# Altium project ALLINONE_V1.0.PrjPcb
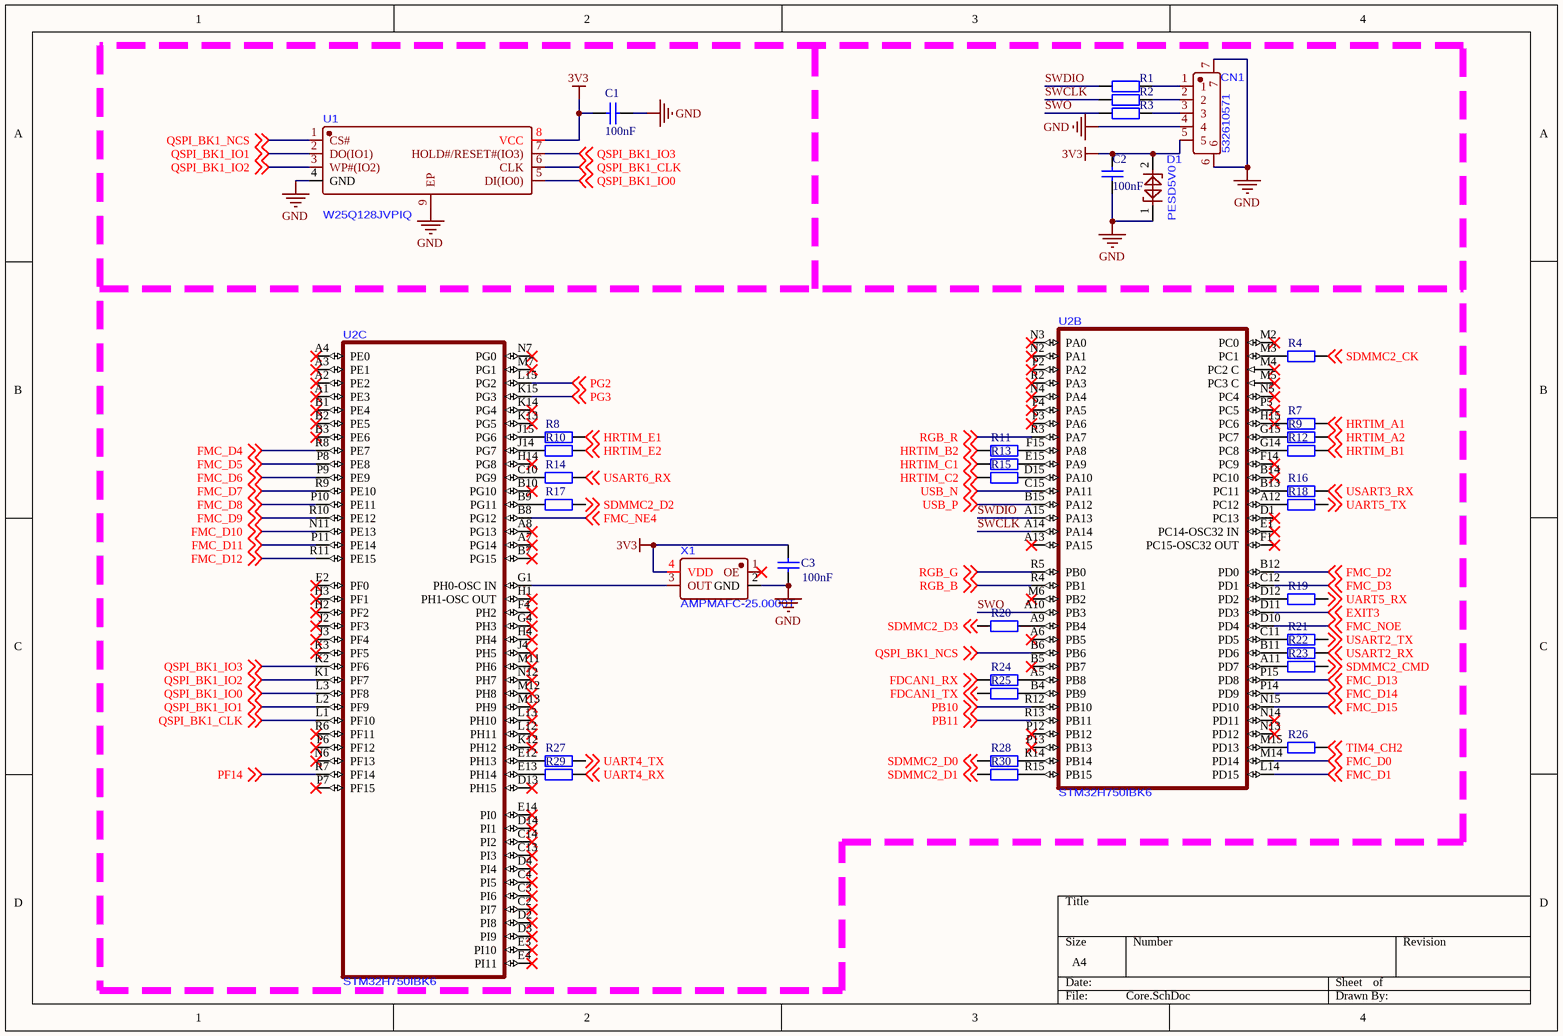
[diagram p0: Core.SchDoc]
7 sheets, 278 parts. Net scope: global (net labels, ports and power ports of the same name join across sheets).
Board file: ALLINONE_V1.0.PcbDoc
Sheets:
  Core.SchDoc
  Power_1.SchDoc
  Power_2.SchDoc
  ADC.SchDoc
  HBridge.SchDoc
  Port.SchDoc
  Others.SchDoc

## Sheet Core.SchDoc
size A4; SheetNumber: 1; SheetTotal: 7

### Parts
C1  100nF  [0402_C]
C2  100nF  [0402_C]
C3  100nF  [0402_C]
CN1  532610571  [CONN-SMD_5P-P1.25_532610571-2]
D1  PESD5V0  [SOD-882_L1.0-W0.6-BI]
R1  100Ω  [0402_R]  (value not drawn)
R2  100Ω  [0402_R]  (value not drawn)
R3  100Ω  [0402_R]  (value not drawn)
R4  10Ω  [0402_R]  (value not drawn)
R7  10Ω  [0402_R]  (value not drawn)
R8  10Ω  [0402_R]  (value not drawn)
R9  10Ω  [0402_R]  (value not drawn)
R10  10Ω  [0402_R]  (value not drawn)
R11  10Ω  [0402_R]  (value not drawn)
R12  10Ω  [0402_R]  (value not drawn)
R13  10Ω  [0402_R]  (value not drawn)
R14  10Ω  [0402_R]  (value not drawn)
R15  10Ω  [0402_R]  (value not drawn)
R16  10Ω  [0402_R]  (value not drawn)
R17  10Ω  [0402_R]  (value not drawn)
R18  10Ω  [0402_R]  (value not drawn)
R19  10Ω  [0402_R]  (value not drawn)
R20  10Ω  [0402_R]  (value not drawn)
R21  10Ω  [0402_R]  (value not drawn)
R22  10Ω  [0402_R]  (value not drawn)
R23  10Ω  [0402_R]  (value not drawn)
R24  10Ω  [0402_R]  (value not drawn)
R25  10Ω  [0402_R]  (value not drawn)
R26  10Ω  [0402_R]  (value not drawn)
R27  10Ω  [0402_R]  (value not drawn)
R28  10Ω  [0402_R]  (value not drawn)
R29  10Ω  [0402_R]  (value not drawn)
R30  10Ω  [0402_R]  (value not drawn)
U1  W25Q128JVPIQ  [WSON-8]
U2  STM32H750IBK6  [UFBGA176+25]  (parts B,C of 3)
X1  AMPMAFC-25.0000T  [OSC-SMD_4P-L2.0-W1.6-BL_ABRACON_AMPMAXXX]

### Nets
3V3: C1.2 C2.2 C3.2 CN1.5 D1.2 U1.8(VCC) X1.4(VDD)
GND: C1.1 C2.1 C3.1 CN1.4 CN1.6 CN1.7 D1.1 U1.4(GND) U1.9(EP) X1.2(GND)
EXIT3: U2.D11(PD3) ; off-sheet EXIT3
FDCAN1_RX: R24.1 ; off-sheet FDCAN1_RX
FDCAN1_TX: R25.1 ; off-sheet FDCAN1_TX
FMC_D0: U2.M14(PD14) ; off-sheet FMC_D0
FMC_D1: U2.L14(PD15) ; off-sheet FMC_D1
FMC_D2: U2.B12(PD0) ; off-sheet FMC_D2
FMC_D3: U2.C12(PD1) ; off-sheet FMC_D3
FMC_D4: U2.R8(PE7) ; off-sheet FMC_D4
FMC_D5: U2.P8(PE8) ; off-sheet FMC_D5
FMC_D6: U2.P9(PE9) ; off-sheet FMC_D6
FMC_D7: U2.R9(PE10) ; off-sheet FMC_D7
FMC_D8: U2.P10(PE11) ; off-sheet FMC_D8
FMC_D9: U2.R10(PE12) ; off-sheet FMC_D9
FMC_D10: U2.N11(PE13) ; off-sheet FMC_D10
FMC_D11: U2.P11(PE14) ; off-sheet FMC_D11
FMC_D12: U2.R11(PE15) ; off-sheet FMC_D12
FMC_D13: U2.P15(PD8) ; off-sheet FMC_D13
FMC_D14: U2.P14(PD9) ; off-sheet FMC_D14
FMC_D15: U2.N15(PD10) ; off-sheet FMC_D15
FMC_NE4: U2.B8(PG12) ; off-sheet FMC_NE4
FMC_NOE: U2.D10(PD4) ; off-sheet FMC_NOE
HRTIM_A1: R7.2 ; off-sheet HRTIM_A1
HRTIM_A2: R9.2 ; off-sheet HRTIM_A2
HRTIM_B1: R12.2 ; off-sheet HRTIM_B1
HRTIM_B2: R11.1 ; off-sheet HRTIM_B2
HRTIM_C1: R13.1 ; off-sheet HRTIM_C1
HRTIM_C2: R15.1 ; off-sheet HRTIM_C2
HRTIM_E1: R8.2 ; off-sheet HRTIM_E1
HRTIM_E2: R10.2 ; off-sheet HRTIM_E2
PB10: U2.R12(PB10) ; off-sheet PB10
PB11: U2.R13(PB11) ; off-sheet PB11
PF14: U2.R7(PF14) ; off-sheet PF14
PG2: U2.L15(PG2) ; off-sheet PG2
PG3: U2.K15(PG3) ; off-sheet PG3
QSPI_BK1_CLK: U1.6(CLK) U2.L1(PF10) ; off-sheet QSPI_BK1_CLK
QSPI_BK1_IO0: U1.5(DI(IO0)) U2.L3(PF8) ; off-sheet QSPI_BK1_IO0
QSPI_BK1_IO1: U1.2(DO(IO1)) U2.L2(PF9) ; off-sheet QSPI_BK1_IO1
QSPI_BK1_IO2: U1.3(WP#(IO2)) U2.K1(PF7) ; off-sheet QSPI_BK1_IO2
QSPI_BK1_IO3: U1.7(HOLD#/RESET#(IO3)) U2.K2(PF6) ; off-sheet QSPI_BK1_IO3
QSPI_BK1_NCS: U1.1(CS#) U2.B6(PB6) ; off-sheet QSPI_BK1_NCS
RGB_B: U2.R4(PB1) ; off-sheet RGB_B
RGB_G: U2.R5(PB0) ; off-sheet RGB_G
RGB_R: U2.R3(PA7) ; off-sheet RGB_R
SDMMC2_CK: R4.2 ; off-sheet SDMMC2_CK
SDMMC2_CMD: R23.2 ; off-sheet SDMMC2_CMD
SDMMC2_D0: R28.1 ; off-sheet SDMMC2_D0
SDMMC2_D1: R30.1 ; off-sheet SDMMC2_D1
SDMMC2_D2: R17.2 ; off-sheet SDMMC2_D2
SDMMC2_D3: R20.1 ; off-sheet SDMMC2_D3
SWCLK: R2.1 U2.A14(PA14)
SWDIO: R1.1 U2.A15(PA13)
SWO: R3.1 U2.A10(PB3)
TIM4_CH2: R26.2 ; off-sheet TIM4_CH2
UART4_RX: R29.1 ; off-sheet UART4_RX
UART4_TX: R27.1 ; off-sheet UART4_TX
UART5_RX: R19.1 ; off-sheet UART5_RX
UART5_TX: R18.1 ; off-sheet UART5_TX
USART2_RX: R22.2 ; off-sheet USART2_RX
USART2_TX: R21.2 ; off-sheet USART2_TX
USART3_RX: R16.2 ; off-sheet USART3_RX
USART6_RX: R14.2 ; off-sheet USART6_RX
USB_N: U2.C15(PA11) ; off-sheet USB_N
USB_P: U2.B15(PA12) ; off-sheet USB_P
NetCN1_1: CN1.1 R1.2
NetCN1_2: CN1.2 R2.2
NetCN1_3: CN1.3 R3.2
NetR4_1: R4.1 U2.M3(PC1)
NetR7_1: R7.1 U2.H15(PC6)
NetR8_1: R8.1 U2.J15(PG6)
NetR9_1: R9.1 U2.G15(PC7)
NetR10_1: R10.1 U2.J14(PG7)
NetR11_2: R11.2 U2.F15(PA8)
NetR12_1: R12.1 U2.G14(PC8)
NetR13_2: R13.2 U2.E15(PA9)
NetR14_1: R14.1 U2.C10(PG9)
NetR15_2: R15.2 U2.D15(PA10)
NetR16_1: R16.1 U2.B13(PC11)
NetR17_1: R17.1 U2.B9(PG11)
NetR18_2: R18.2 U2.A12(PC12)
NetR19_2: R19.2 U2.D12(PD2)
NetR20_2: R20.2 U2.A9(PB4)
NetR21_1: R21.1 U2.C11(PD5)
NetR22_1: R22.1 U2.B11(PD6)
NetR23_1: R23.1 U2.A11(PD7)
NetR24_2: R24.2 U2.A5(PB8)
NetR25_2: R25.2 U2.B4(PB9)
NetR26_1: R26.1 U2.M15(PD13)
NetR27_2: R27.2 U2.E12(PH13)
NetR28_2: R28.2 U2.R14(PB14)
NetR29_2: R29.2 U2.E13(PH14)
NetR30_2: R30.2 U2.R15(PB15)
NetU2_G1: U2.G1(PH0-OSC_IN) X1.3(OUT)

Not connected (* = marked no-connect by the designer): U2 A1(PE3)* A2(PE2)* A3(PE1)* A4(PE0)* A6(PB5)* A7(PG14)* A8(PG13)* A13(PA15)* B1(PE4)* B2(PE5)* B3(PE6)* B5(PB7)* B7(PG15)* B10(PG10)* B14(PC10)* C2(PI7)* C3(PI6)* C4(PI5)* C13(PI3)* C14(PI2)* D1(PC13)* D2(PI8)* D3(PI9)* D4(PI4)* D13(PH15)* D14(PI1)* E1(PC14-OSC32_IN)* E2(PF0)* E3(PI10)* E4(PI11)* E14(PI0)* F1(PC15-OSC32_OUT)* F4(PH2)* F14(PC9)* G4(PH3)* H1(PH1-OSC_OUT)* H2(PF2)* H3(PF1)* H4(PH4)* H14(PG8)* J2(PF3)* J3(PF4)* J4(PH5)* K3(PF5)* K12(PH12)* K13(PG5)* K14(PG4)* L12(PH11)* L13(PH10)* M2(PC0)* M4(PC2_C)* M5(PC3_C)* M6(PB2)* M7(PG1)* M11(PH6)* M12(PH8)* M13(PH9)* N2(PA1)* N3(PA0)* N4(PA4)* N5(PC4)* N6(PF13)* N7(PG0)* N12(PH7)* N13(PD12)* N14(PD11)* P2(PA2)* P3(PA6)* P4(PA5)* P5(PC5)* P6(PF12)* P7(PF15)* P12(PB12)* P13(PB13)* R2(PA3)* R6(PF11)*; X1 1(OE)*

### Library data of the parts
C1-C3 = 0402 100nF (104) 10% 16V: 贴片电容; ComponentLink1Description: 供应商链接; ComponentLink1URL: http://www.szlcsc.com/product/details_1877.html; Package: 0402; Supplier: LC; SuppliersPartNumber: C1525
D1 = PESD5V0F1BL,315
R1-R3 = 0402 10KΩ (1002) 1%: 贴片电阻; ComponentLink1Description: 供应商链接; ComponentLink1URL: http://www.szlcsc.com/product/details_26487.html; Package: 0402; Supplier: LC; SuppliersPartNumber: C25744
R4 R7-R30 = 0402 10Ω (10R0) 1%: 贴片电阻; ComponentLink1Description: 供应商链接; ComponentLink1URL: http://www.szlcsc.com/product/details_25820.html; Package: 0402; Supplier: LC; SuppliersPartNumber: C25077

## Sheet Power_1.SchDoc
size A4; SheetNumber: 2; SheetTotal: 6
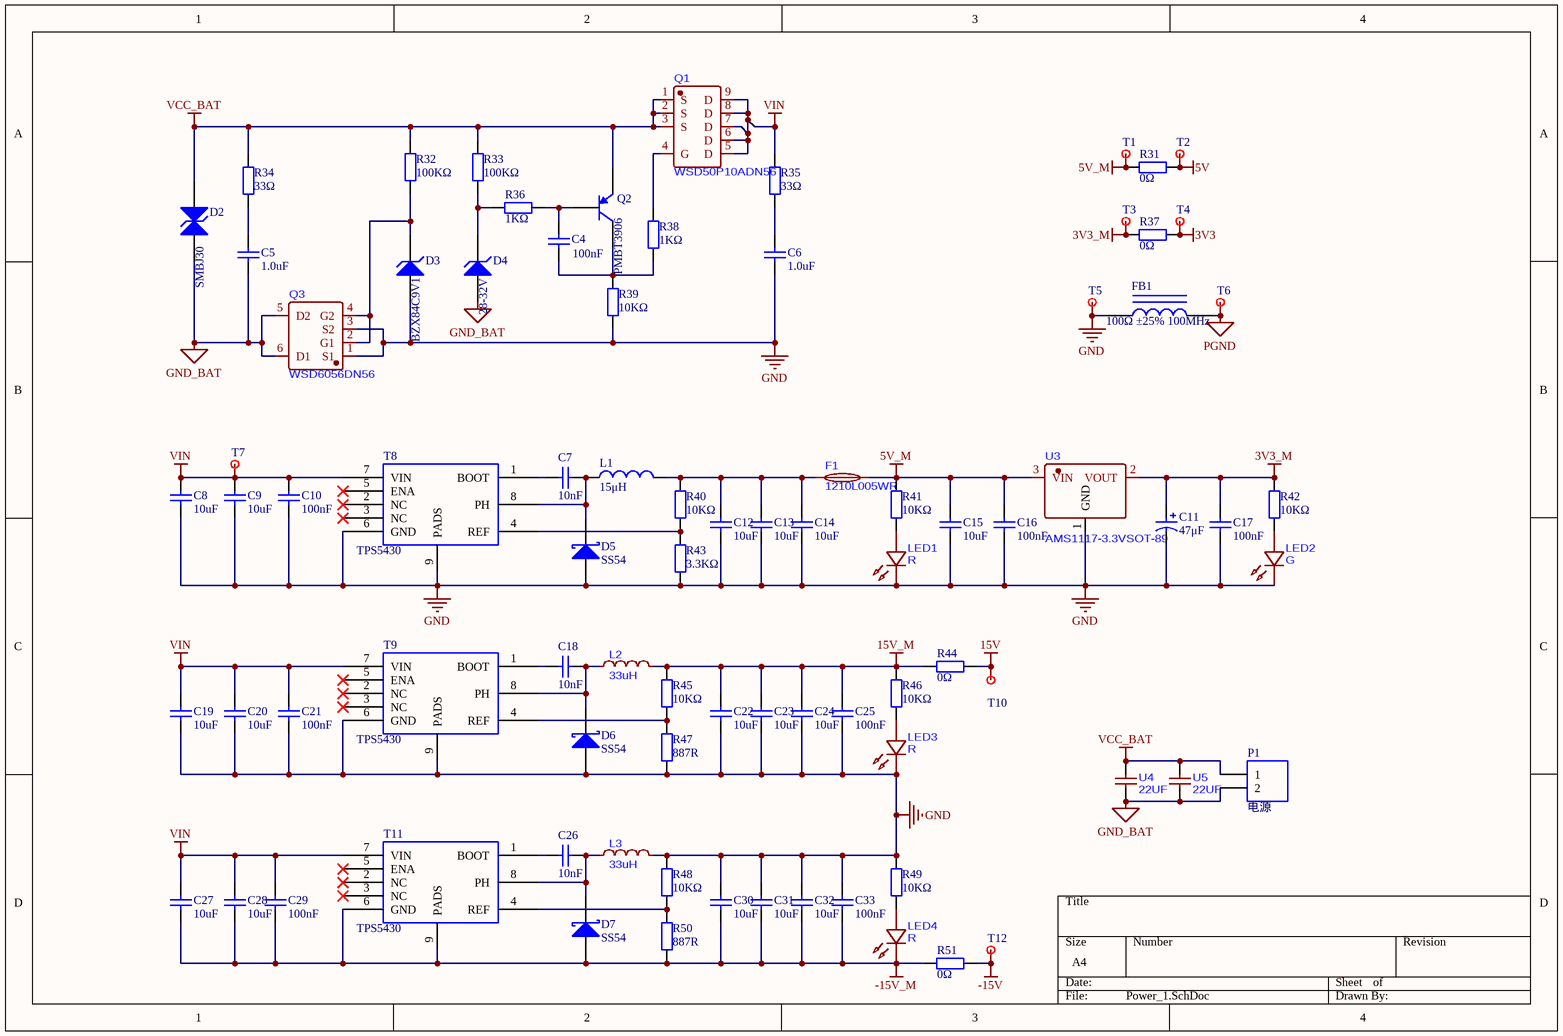
[diagram p1: Power_1.SchDoc]

### Parts
C4  100nF  [0402_C]
C5  1.0uF  [0402_C]
C6  1.0uF  [0402_C]
C7  10nF  [0402_C]
C8  10uF  [1206_C]
C9  10uF  [1206_C]
C10  100nF  [0603_C]
C11  47μF  [钽电容47]
C12  10uF  [1206_C]
C13  10uF  [1206_C]
C14  10uF  [1206_C]
C15  10uF  [0603_C]
C16  100nF  [0603_C]
C17  100nF  [0603_C]
C18  10nF  [0402_C]
C19  10uF  [1206_C]
C20  10uF  [1206_C]
C21  100nF  [0603_C]
C22  10uF  [1206_C]
C23  10uF  [1206_C]
C24  10uF  [1206_C]
C25  100nF  [0603_C]
C26  10nF  [0402_C]
C27  10uF  [1206_C]
C28  10uF  [1206_C]
C29  100nF  [0603_C]
C30  10uF  [1206_C]
C31  10uF  [1206_C]
C32  10uF  [1206_C]
C33  100nF  [0603_C]
D2  SMBJ30  [SMB(DO-214AA)_S1]
D3  BZX84C9V1  [SOD-123]
D4  28-32V  [SOD-123]
D5  SS54  [SS54]
D6  SS54  [SS54]
D7  SS54  [SS54]
F1  1210L005WR  [F1210]
FB1  100Ω ±25% 100MHz  [0805_L]
L1  15μH  [电感]
L2  33uH  [IND-SMD_L5.5-W5.0]
L3  33uH  [IND-SMD_L5.5-W5.0]
LED1  R  [LED0402-RD]
LED2  G  [LED0402-RD]
LED3  R  [LED0402-RD]
LED4  R  [LED0402-RD]
P1  电源  [XT30U公头]
Q1  WSD50P10ADN56  [DFN-8_L5.8-W4.9-P1.27-LS6.0-BL-1]
Q2  PMBT3906  [SOT-23]
Q3  WSD6056DN56  [DFN-8_L5.5-W5.2-P1.27-LS6.0-BL-EP2]
R31  0Ω  [0603_R]
R32  100KΩ  [0402_R]
R33  100KΩ  [0402_R]
R34  33Ω  [0402_R]
R35  33Ω  [0402_R]
R36  1KΩ  [0402_R]
R37  0Ω  [0603_R]
R38  1KΩ  [0402_R]
R39  10KΩ  [0402_R]
R40  10KΩ  [0402_R]
R41  10KΩ  [0402_R]
R42  10KΩ  [0402_R]
R43  3.3KΩ  [0402_R]
R44  0Ω  [0603_R]
R45  10KΩ  [0402_R]
R46  10KΩ  [0402_R]
R47  887R  [0402_R]
R48  10KΩ  [0402_R]
R49  10KΩ  [0402_R]
R50  887R  [0402_R]
R51  0Ω  [0603_R]
T1  testpoint  [testpoint]  (value not drawn)
T2  testpoint  [testpoint]  (value not drawn)
T3  testpoint  [testpoint]  (value not drawn)
T4  testpoint  [testpoint]  (value not drawn)
T5  testpoint  [testpoint]  (value not drawn)
T6  testpoint  [testpoint]  (value not drawn)
T7  testpoint  [testpoint]  (value not drawn)
T8  TPS5430  [TPS5430DDAR]
T9  TPS5430  [TPS5430DDAR]
T10  testpoint  [testpoint]  (value not drawn)
T11  TPS5430  [TPS5430DDAR]
T12  testpoint  [testpoint]  (value not drawn)
U3  AMS1117-3.3VSOT-89  [SOT-89-3_L4.5-W2.5-P1.50-LS4.2-BR]
U4  22UF  [C1812]
U5  22UF  [C1812]

### Nets
3V3: R37.2 T4.1(R)
3V3_M: C11.1 C17.2 R37.1 R42.2 T3.1(R) U3.2(VOUT)
5V: R31.2 T2.1(R)
5V_M: C15.2 C16.2 F1.2 R31.1 R41.2 T1.1(R) U3.3(VIN)
15V: R44.2 T10.1(R)
15V_M: C22.2 C23.2 C24.2 C25.2 L2.2 R44.1 R45.2 R46.2
-15V: R51.2 T12.1(R)
-15V_M: C27.1 C28.1 C29.1 C30.1 C31.1 C32.1 C33.1 D7.1(A) LED4.1(K) R50.1 R51.1 T11.6(GND) T11.9(PADS)
GND: C6.1 C8.1 C9.1 C10.1 C11.2 C12.1 C13.1 C14.1 C15.1 C16.1 C17.1 C19.1 C20.1 C21.1 C22.1 C23.1 C24.1 C25.1 C30.2 C31.2 C32.2 C33.2 D3.1(A) D5.1(A) D6.1(A) FB1.1 L3.2 LED1.1(K) LED2.1(K) LED3.1(K) Q3.1(S1) Q3.3(S2) R39.2 R43.1 R47.1 R48.2 R49.2 T5.1(R) T8.6(GND) T8.9(PADS) T9.6(GND) T9.9(PADS) U3.1(GND)
GND_BAT: C5.1 D2.1(A) D4.1(A) P1.2 Q3.5(D2) Q3.6(D1) U4.1 U5.1
PGND: FB1.2 T6.1(R)
VCC_BAT: D2.2(K) P1.1 Q1.1(S) Q1.2(S) Q1.3(S) Q2.2(E) R32.2 R33.2 R34.2 U4.2 U5.2
VIN: C8.2 C9.2 C10.2 C19.2 C20.2 C21.2 C27.2 C28.2 C29.2 Q1.5(D) Q1.6(D) Q1.7(D) Q1.8(D) Q1.9(D) R35.2 T7.1(R) T8.7(VIN) T9.7(VIN) T11.7(VIN)
NetC4_1: C4.1 Q2.3(C) R38.1 R39.1
NetC4_2: C4.2 Q2.1(B) R36.2
NetC5_2: C5.2 R34.1
NetC6_2: C6.2 R35.1
NetC7_1: C7.1 T8.1(BOOT)
NetC7_2: C7.2 D5.2(K) L1.1 T8.8(PH)
NetC12_2: C12.2 C13.2 C14.2 F1.1 L1.2 R40.2
NetC18_1: C18.1 T9.1(BOOT)
NetC18_2: C18.2 D6.2(K) L2.1 T9.8(PH)
NetC26_1: C26.1 T11.1(BOOT)
NetC26_2: C26.2 D7.2(K) L3.1 T11.8(PH)
NetD3_2: D3.2(K) Q3.2(G1) Q3.4(G2) R32.1
NetD4_2: D4.2(K) R33.1 R36.1
NetLED1_2: LED1.2(A) R41.1
NetLED2_2: LED2.2(A) R42.1
NetLED3_2: LED3.2(A) R46.1
NetLED4_2: LED4.2(A) R49.1
NetQ1_4: Q1.4(G) R38.2
NetR40_1: R40.1 R43.2 T8.4(REF)
NetR45_1: R45.1 R47.2 T9.4(REF)
NetR48_1: R48.1 R50.2 T11.4(REF)

Not connected (* = marked no-connect by the designer): T8 2(NC)* 3(NC)* 5(ENA)*; T9 2(NC)* 3(NC)* 5(ENA)*; T11 2(NC)* 3(NC)* 5(ENA)*

### Library data of the parts
C4 = 0402 100nF (104) 10% 16V: 贴片电容; ComponentLink1Description: 供应商链接; ComponentLink1URL: http://www.szlcsc.com/product/details_1877.html; Package: 0402; Supplier: LC; SuppliersPartNumber: C1525
C5 C6 = 0402 1.0uF (105) 10% 25V: 贴片电容; ComponentLink1Description: 供应商链接; ComponentLink1URL: http://www.szlcsc.com/product/details_53938.html; Package: 0402; Supplier: LC; SuppliersPartNumber: C52923
C7 C18 C26 = 0402 10nF (103) 10% 50V: 贴片电容; ComponentLink1Description: 供应商链接; ComponentLink1URL: http://www.szlcsc.com/product/details_15869.html; Package: 0402; Supplier: LC; SuppliersPartNumber: C15195
C8 C9 C12-C14 C19 C20 C22-C24 C27 C28 C30-C32 = 1206 10uF (106) 10% 50V: 贴片电容; ComponentLink1Description: 供应商链接; ComponentLink1URL: http://www.szlcsc.com/product/details_14236.html; Package: 1206; Supplier: LC; SuppliersPartNumber: C13585
C10 C15-C17 C21 C25 C29 C33 = 0603 100nF (104) 10% 50V: 贴片电容; ComponentLink1Description: 供应商链接; ComponentLink1URL: http://www.szlcsc.com/product/details_15331.html; Package: 0603; Supplier: LC; SuppliersPartNumber: C14663
C11 = 47μF: 钽电容; Published: 8-Jun-2000; LatestRevisionDate: 29-May-2009; LatestRevisionNote: IPC-7351 Footprint Added.; PackageReference: C0805; Publisher: Altium Limited; PackageDescription: Chip Capacitor
D2 = SMB/DO-214AA P6SMB6.8CA: TVS; ComponentLink1Description: 供应商链接; ComponentLink1URL: http://www.szlcsc.com/product/details_79530.html; Package: SMB/DO-214AA; Supplier: LC; SuppliersPartNumber: C78395
D3 D4 = 稳压二极管: ComponentLink1Description: 供应商链接; ComponentLink1URL: http://www.szlcsc.com/product/details_8541.html; Package: LL-34; Supplier: LC; SuppliersPartNumber: C8062
D5-D7 = SS54: Schottky Diode; Published: 8-Jun-2000; LatestRevisionDate: 17-Jul-2002; LatestRevisionNote: Re-released for DXP Platform.; PackageReference: SMB; Publisher: Altium Limited; PackageDescription: DO-214-AA/SMB; 2 C-Bend Leads; Body 5.3 x 3.6 mm, inc. leads (LxW); Code_JEDEC: DO-214-AA
FB1 = 0805 100Ω 25% 100MHz: 贴片磁珠; ComponentLink1Description: 供应商链接; ComponentLink1URL: http://www.szlcsc.com/product/details_1367.html; Package: 0805; Supplier: LC; SuppliersPartNumber: C1015
L1 = 15μH: 贴片电感; Code_IEC: 1005; Published: 8-Jun-2000; LatestRevisionDate: 29-May-2009; LatestRevisionNote: IPC-7351 Footprint Added.; PackageReference: 0402-A; Publisher: Altium Limited; PackageDescription: Chip Inductor; Code_JEITA: 0402
L2 L3 = YXMAC0502-3R3M-ANF
LED1-LED4 = TJ-S1005CL4T5ALC3DW-A5
P1 = XT30公头立式: Header, 2-Pin; LatestRevisionDate: 17-Jul-2002; LatestRevisionNote: Re-released for DXP Platform.; Publisher: Altium Limited
Q2 = PNP三极管: 三极管; ComponentLink1Description: 供应商链接; ComponentLink1URL: http://www.szlcsc.com/product/details_9037.html; Package: SOT-23; Supplier: LC; SuppliersPartNumber: C8542
R31 R37 R44 R51 = 0603 0Ω (0R0) 1%: 贴片电阻; ComponentLink1Description: 供应商链接; ComponentLink1URL: http://www.szlcsc.com/product/details_21903.html; Package: 0603; Supplier: LC; SuppliersPartNumber: C21189
R32 R33 = 0402 100KΩ (1003) 1%: 贴片电阻; ComponentLink1Description: 供应商链接; ComponentLink1URL: http://www.szlcsc.com/product/details_26484.html; Package: 0402; Supplier: LC; SuppliersPartNumber: C25741
R34 R35 = 0402 33Ω (33R0) 1%: 贴片电阻; ComponentLink1Description: 供应商链接; ComponentLink1URL: http://www.szlcsc.com/product/details_25848.html; Package: 0402; Supplier: LC; SuppliersPartNumber: C25105
R36 R38 = 0402 1KΩ (1001) 1%: 贴片电阻; ComponentLink1Description: 供应商链接; ComponentLink1URL: http://www.szlcsc.com/product/details_12256.html; Package: 0402; Supplier: LC; SuppliersPartNumber: C11702
R39-R42 R45 R46 R48 R49 = 0402 10KΩ (1002) 1%: 贴片电阻; ComponentLink1Description: 供应商链接; ComponentLink1URL: http://www.szlcsc.com/product/details_26487.html; Package: 0402; Supplier: LC; SuppliersPartNumber: C25744
R43 R47 R50 = 0402 3.3KΩ (3301) 1%: 贴片电阻; ComponentLink1Description: 供应商链接; ComponentLink1URL: http://www.szlcsc.com/product/details_26633.html; Package: 0402; Supplier: LC; SuppliersPartNumber: C25890
T8 T9 T11 = TPS5430: 24V-5V
U4 U5 = 100UF/50V-1812

## Sheet Power_2.SchDoc
size A4; SheetNumber: 3; SheetTotal: 7
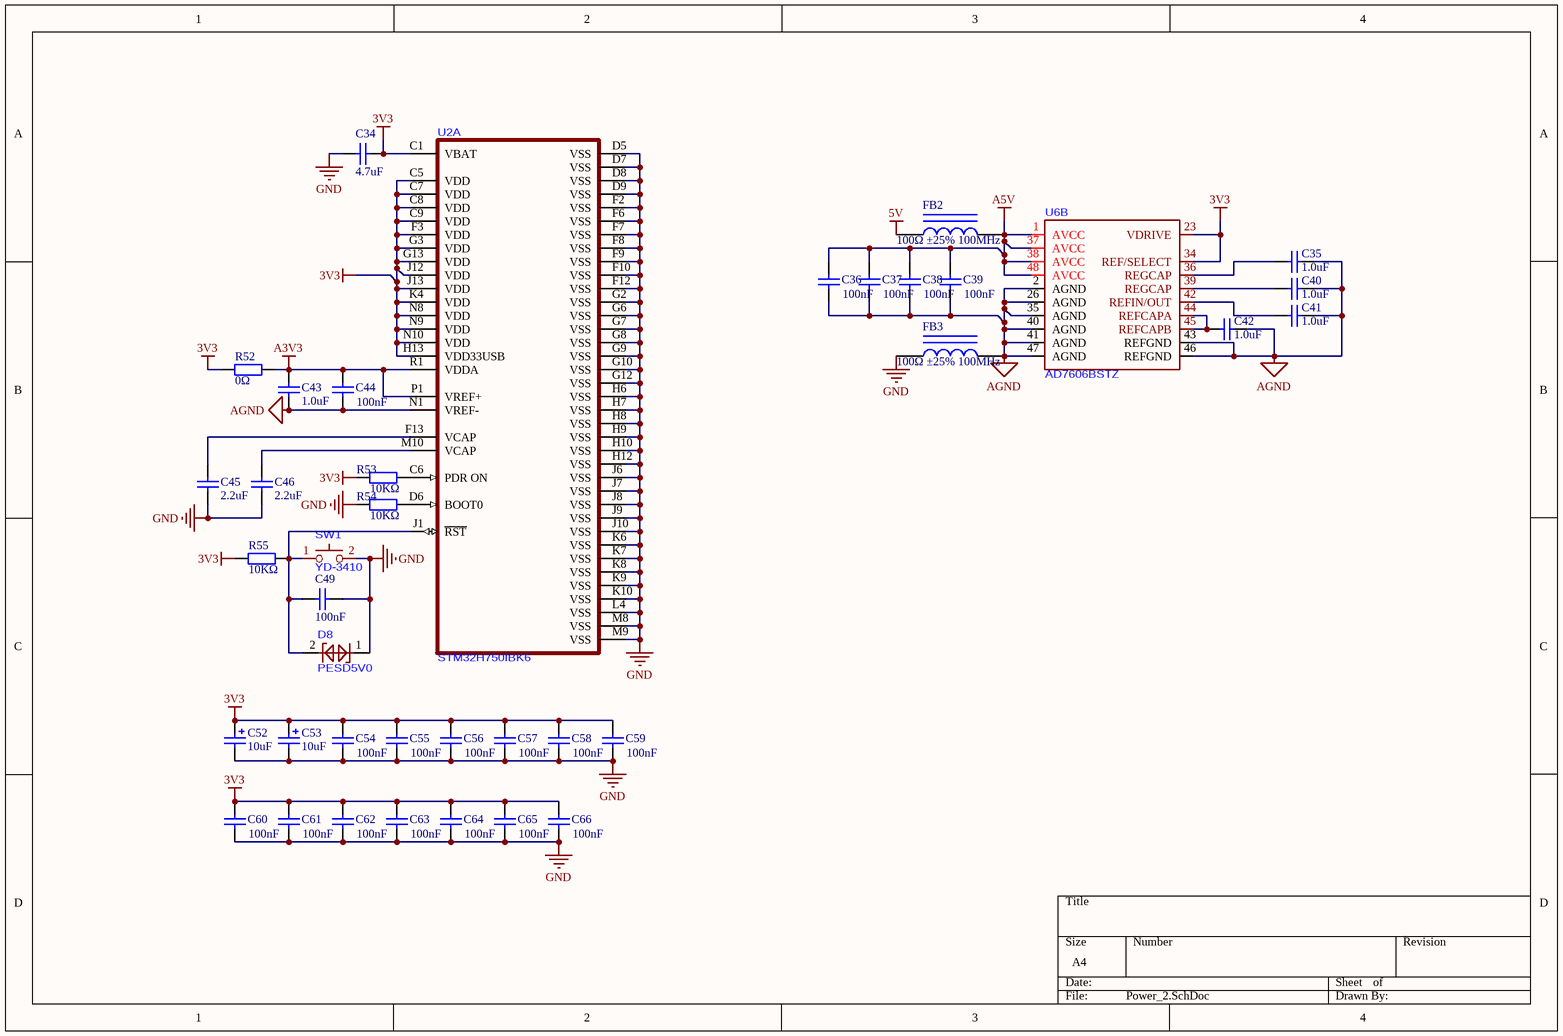
[diagram p2: Power_2.SchDoc]

### Parts
C34  4.7uF  [0402_C]
C35  1.0uF  [0402_C]
C36  100nF  [0402_C]
C37  100nF  [0402_C]
C38  100nF  [0402_C]
C39  100nF  [0402_C]
C40  1.0uF  [0402_C]
C41  1.0uF  [0402_C]
C42  1.0uF  [0402_C]
C43  1.0uF  [0402_C]
C44  100nF  [0402_C]
C45  2.2uF  [0402_C]
C46  2.2uF  [0402_C]
C49  100nF  [0402_C]
C52  10uF  [CASE-A_3216]
C53  10uF  [CASE-A_3216]
C54  100nF  [0402_C]
C55  100nF  [0402_C]
C56  100nF  [0402_C]
C57  100nF  [0402_C]
C58  100nF  [0402_C]
C59  100nF  [0402_C]
C60  100nF  [0402_C]
C61  100nF  [0402_C]
C62  100nF  [0402_C]
C63  100nF  [0402_C]
C64  100nF  [0402_C]
C65  100nF  [0402_C]
C66  100nF  [0402_C]
D8  PESD5V0  [SOD-882_L1.0-W0.6-BI]
FB2  100Ω ±25% 100MHz  [0805_L]
FB3  100Ω ±25% 100MHz  [0805_L]
R52  0Ω  [0402_R]
R53  10KΩ  [0402_R]
R54  10KΩ  [0402_R]
R55  10KΩ  [0402_R]
SW1  YD-3410  [SW-SMD_L3.9-W2.9-LS4.8-EH-A]
U2  STM32H750IBK6  [UFBGA176+25]  (part A of 3)
U6  AD7606BSTZ  [LQFP-64_L10.0-W10.0-P0.50-LS12.0-TL]  (part B of 2)

### Nets
3V3: C34.2 C52.1 C53.1 C54.2 C55.2 C56.2 C57.2 C58.2 C59.2 C60.2 C61.2 C62.2 C63.2 C64.2 C65.2 C66.2 R52.1 R53.2 R55.1 U2.C1(VBAT) U2.C5(VDD) U2.C7(VDD) U2.C8(VDD) U2.C9(VDD) U2.F3(VDD) U2.G3(VDD) U2.G13(VDD) U2.H13(VDD33USB) U2.J12(VDD) U2.J13(VDD) U2.K4(VDD) U2.N8(VDD) U2.N9(VDD) U2.N10(VDD) U6.23(VDRIVE) U6.34(REF/SELECT)
5V: FB2.1
A3V3: C43.2 C44.2 R52.2 U2.P1(VREF+) U2.R1(VDDA)
A5V: C36.2 C37.2 C38.2 C39.2 FB2.2 U6.1(AVCC) U6.37(AVCC) U6.38(AVCC) U6.48(AVCC)
AGND: C35.1 C36.1 C37.1 C38.1 C39.1 C40.1 C41.1 C42.1 C43.1 C44.1 FB3.2 U2.N1(VREF-) U6.2(AGND) U6.26(AGND) U6.35(AGND) U6.40(AGND) U6.41(AGND) U6.43(REFGND) U6.46(REFGND) U6.47(AGND)
GND: C34.1 C45.1 C46.1 C49.1 C52.2 C53.2 C54.1 C55.1 C56.1 C57.1 C58.1 C59.1 C60.1 C61.1 C62.1 C63.1 C64.1 C65.1 C66.1 D8.1 FB3.1 R54.2 SW1.2 U2.D5(VSS) U2.D7(VSS) U2.D8(VSS) U2.D9(VSS) U2.F2(VSS) U2.F6(VSS) U2.F7(VSS) U2.F8(VSS) U2.F9(VSS) U2.F10(VSS) U2.F12(VSS) U2.G2(VSS) U2.G6(VSS) U2.G7(VSS) U2.G8(VSS) U2.G9(VSS) U2.G10(VSS) U2.G12(VSS) U2.H6(VSS) U2.H7(VSS) U2.H8(VSS) U2.H9(VSS) U2.H10(VSS) U2.H12(VSS) U2.J6(VSS) U2.J7(VSS) U2.J8(VSS) U2.J9(VSS) U2.J10(VSS) U2.K6(VSS) U2.K7(VSS) U2.K8(VSS) U2.K9(VSS) U2.K10(VSS) U2.L4(VSS) U2.M8(VSS) U2.M9(VSS)
NetC35_2: C35.2 U6.36(REGCAP)
NetC40_2: C40.2 U6.39(REGCAP)
NetC41_2: C41.2 U6.42(REFIN/OUT)
NetC42_2: C42.2 U6.44(REFCAPA) U6.45(REFCAPB)
NetC45_2: C45.2 U2.F13(VCAP)
NetC46_2: C46.2 U2.M10(VCAP)
NetC49_2: C49.2 D8.2 R55.2 SW1.1 U2.J1(~{RST})
NetR53_1: R53.1 U2.C6(PDR_ON)
NetR54_1: R54.1 U2.D6(BOOT0)

### Library data of the parts
C34 = 0402 4.7uF (475) 20% 10V: 贴片电容; ComponentLink1Description: 供应商链接; ComponentLink1URL: http://www.szlcsc.com/product/details_24469.html; Package: 0402; Supplier: LC; SuppliersPartNumber: C23733
C35 C40-C43 C45 C46 = 0402 1.0uF (105) 10% 25V: 贴片电容; ComponentLink1Description: 供应商链接; ComponentLink1URL: http://www.szlcsc.com/product/details_53938.html; Package: 0402; Supplier: LC; SuppliersPartNumber: C52923
C36-C39 C44 C49 C54-C66 = 0402 100nF (104) 10% 16V: 贴片电容; ComponentLink1Description: 供应商链接; ComponentLink1URL: http://www.szlcsc.com/product/details_1877.html; Package: 0402; Supplier: LC; SuppliersPartNumber: C1525
C52 C53 = 3216 10uF (106) 10% 16V: 钽电容; ComponentLink1Description: 供应商链接; ComponentLink1URL: http://www.szlcsc.com/product/details_7643.html; Package: 3216; Supplier: LC; SuppliersPartNumber: C7171
D8 = PESD5V0F1BL,315
FB2 FB3 = 0805 100Ω 25% 100MHz: 贴片磁珠; ComponentLink1Description: 供应商链接; ComponentLink1URL: http://www.szlcsc.com/product/details_1367.html; Package: 0805; Supplier: LC; SuppliersPartNumber: C1015
R52 = 0402 0Ω (0R0) 1%: 贴片电阻; ComponentLink1Description: 供应商链接; ComponentLink1URL: http://www.szlcsc.com/product/details_17853.html; Package: 0402; Supplier: LC; SuppliersPartNumber: C17168
R53-R55 = 0402 10KΩ (1002) 1%: 贴片电阻; ComponentLink1Description: 供应商链接; ComponentLink1URL: http://www.szlcsc.com/product/details_26487.html; Package: 0402; Supplier: LC; SuppliersPartNumber: C25744

## Sheet ADC.SchDoc
size A4; SheetNumber: 4; SheetTotal: 7
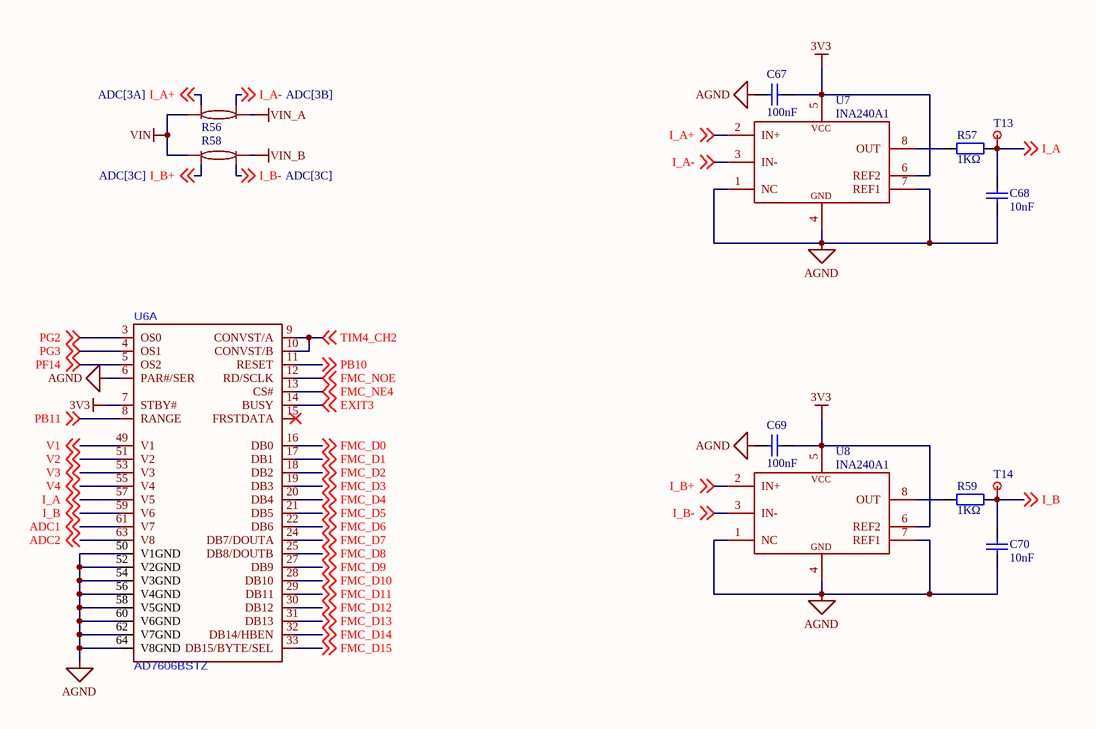
[diagram p3: ADC.SchDoc]

### Parts
C67  100nF  [0402_C]
C68  10nF  [0402_C]
C69  100nF  [0402_C]
C70  10nF  [0402_C]
R56  1206_2mR_1W  [1206_2mΩ_1W]  (value not drawn)
R57  1KΩ  [0402_R]
R58  1206_2mR_1W  [1206_2mΩ_1W]  (value not drawn)
R59  1KΩ  [0402_R]
T13  testpoint  [testpoint]  (value not drawn)
T14  testpoint  [testpoint]  (value not drawn)
U6  AD7606BSTZ  [LQFP-64_L10.0-W10.0-P0.50-LS12.0-TL]  (part A of 2)
U7  INA240A1  [TSSOP8]
U8  INA240A1  [TSSOP8]

### Nets
3V3: C67.1 C69.1 U6.7(STBY#) U7.5(VS) U7.6(REF2) U8.5(VS) U8.6(REF2)
AGND: C67.2 C68.2 C69.2 C70.2 U6.6(PAR#/SER) U6.50(V1GND) U6.52(V2GND) U6.54(V3GND) U6.56(V4GND) U6.58(V5GND) U6.60(V6GND) U6.62(V7GND) U6.64(V8GND) U7.1(NC) U7.4(GND) U7.7(REF1) U8.1(NC) U8.4(GND) U8.7(REF1)
VIN: R56.1 R58.1
VIN_A: R56.2
VIN_B: R58.2
ADC1: U6.61(V7) ; off-sheet ADC1
ADC2: U6.63(V8) ; off-sheet ADC2
EXIT3: U6.14(BUSY) ; off-sheet EXIT3
FMC_D0: U6.16(DB0) ; off-sheet FMC_D0
FMC_D1: U6.17(DB1) ; off-sheet FMC_D1
FMC_D2: U6.18(DB2) ; off-sheet FMC_D2
FMC_D3: U6.19(DB3) ; off-sheet FMC_D3
FMC_D4: U6.20(DB4) ; off-sheet FMC_D4
FMC_D5: U6.21(DB5) ; off-sheet FMC_D5
FMC_D6: U6.22(DB6) ; off-sheet FMC_D6
FMC_D7: U6.24(DB7/DOUTA) ; off-sheet FMC_D7
FMC_D8: U6.25(DB8/DOUTB) ; off-sheet FMC_D8
FMC_D9: U6.27(DB9) ; off-sheet FMC_D9
FMC_D10: U6.28(DB10) ; off-sheet FMC_D10
FMC_D11: U6.29(DB11) ; off-sheet FMC_D11
FMC_D12: U6.30(DB12) ; off-sheet FMC_D12
FMC_D13: U6.31(DB13) ; off-sheet FMC_D13
FMC_D14: U6.32(DB14/HBEN) ; off-sheet FMC_D14
FMC_D15: U6.33(DB15/BYTE/SEL) ; off-sheet FMC_D15
FMC_NE4: U6.13(CS#) ; off-sheet FMC_NE4
FMC_NOE: U6.12(RD/SCLK) ; off-sheet FMC_NOE
I_A: C68.1 R57.1 T13.1(R) U6.57(V5) ; off-sheet I_A
I_A+: R56.3 U7.2(IN+) ; off-sheet I_A+
I_A-: R56.4 U7.3(IN-) ; off-sheet I_A-
I_B: C70.1 R59.1 T14.1(R) U6.59(V6) ; off-sheet I_B
I_B+: R58.3 U8.2(IN+) ; off-sheet I_B+
I_B-: R58.4 U8.3(IN-) ; off-sheet I_B-
PB10: U6.11(RESET) ; off-sheet PB10
PB11: U6.8(RANGE) ; off-sheet PB11
PF14: U6.5(OS2) ; off-sheet PF14
PG2: U6.3(OS0) ; off-sheet PG2
PG3: U6.4(OS1) ; off-sheet PG3
TIM4_CH2: U6.9(CONVST/A) U6.10(CONVST/B) ; off-sheet TIM4_CH2
V1: U6.49(V1) ; off-sheet V1
V2: U6.51(V2) ; off-sheet V2
V3: U6.53(V3) ; off-sheet V3
V4: U6.55(V4) ; off-sheet V4
NetR57_2: R57.2 U7.8(OUT)
NetR59_2: R59.2 U8.8(OUT)

Not connected (* = marked no-connect by the designer): U6 15(FRSTDATA)*

### Notes on the sheet
- (in symbol INA240Ax) VCC

### Library data of the parts
C67-C70 = 0402 100nF (104) 10% 16V: 贴片电容; ComponentLink1Description: 供应商链接; ComponentLink1URL: http://www.szlcsc.com/product/details_1877.html; Package: 0402; Supplier: LC; SuppliersPartNumber: C1525
R57 R59 = 0402 0Ω (0R0) 1%: 贴片电阻; ComponentLink1Description: 供应商链接; ComponentLink1URL: http://www.szlcsc.com/product/details_17853.html; Package: 0402; Supplier: LC; SuppliersPartNumber: C17168
U7 U8 = INA240Ax: 电流放大器; 厂家: TI

## Sheet HBridge.SchDoc
size A4; SheetNumber: 5; SheetTotal: 7
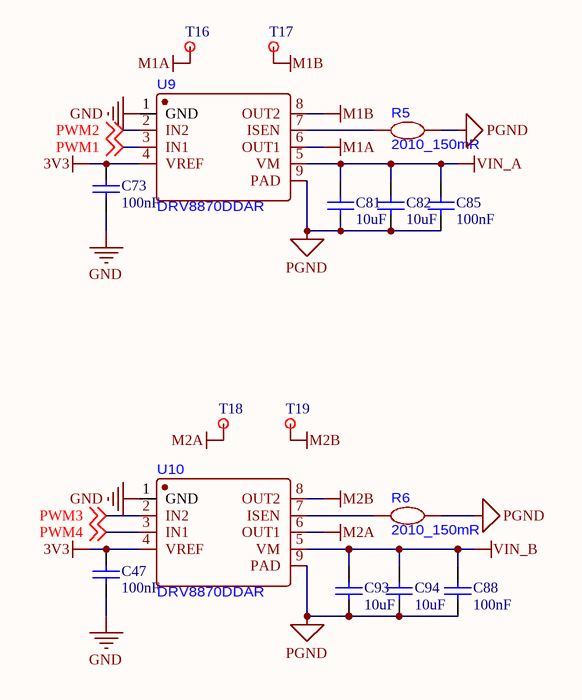
[diagram p4: HBridge.SchDoc]

### Parts
C47  100nF  [0402_C]
C73  100nF  [0402_C]
C81  10uF  [1206_C]
C82  10uF  [1206_C]
C85  100nF  [0402_C]
C88  100nF  [0402_C]
C93  10uF  [1206_C]
C94  10uF  [1206_C]
R5  2010_150mR  [R2010]
R6  2010_150mR  [R2010]
T16  testpoint  [testpoint]  (value not drawn)
T17  testpoint  [testpoint]  (value not drawn)
T18  testpoint  [testpoint]  (value not drawn)
T19  testpoint  [testpoint]  (value not drawn)
U9  DRV8870DDAR  [HSOP-8_L5.0-W4.0-P1.27-LS6.2-BL-EP]
U10  DRV8870DDAR  [HSOP-8_L5.0-W4.0-P1.27-LS6.2-BL-EP]

### Nets
3V3: C47.2 C73.2 U9.4(VREF) U10.4(VREF)
GND: C47.1 C73.1 U9.1(GND) U10.1(GND)
M1A: T16.1(R) U9.6(OUT1)
M1B: T17.1(R) U9.8(OUT2)
M2A: T18.1(R) U10.6(OUT1)
M2B: T19.1(R) U10.8(OUT2)
PGND: C81.1 C82.1 C85.1 C88.1 C93.1 C94.1 R5.2 R6.2 U9.9(PAD) U10.9(PAD)
VIN_A: C81.2 C82.2 C85.2 U9.5(VM)
VIN_B: C88.2 C93.2 C94.2 U10.5(VM)
PWM1: U9.3(IN1) ; off-sheet PWM1
PWM2: U9.2(IN2) ; off-sheet PWM2
PWM3: U10.2(IN2) ; off-sheet PWM3
PWM4: U10.3(IN1) ; off-sheet PWM4
NetR5_1: R5.1 U9.7(ISEN)
NetR6_1: R6.1 U10.7(ISEN)

### Library data of the parts
C47 C73 C85 C88 = 0402 100nF (104) 10% 16V: 贴片电容; ComponentLink1Description: 供应商链接; ComponentLink1URL: http://www.szlcsc.com/product/details_1877.html; Package: 0402; Supplier: LC; SuppliersPartNumber: C1525
C81 C82 C93 C94 = 1206 10uF (106) 10% 50V: 贴片电容; ComponentLink1Description: 供应商链接; ComponentLink1URL: http://www.szlcsc.com/product/details_14236.html; Package: 1206; Supplier: LC; SuppliersPartNumber: C13585

## Sheet Port.SchDoc
size A4; SheetNumber: 6; SheetTotal: 7
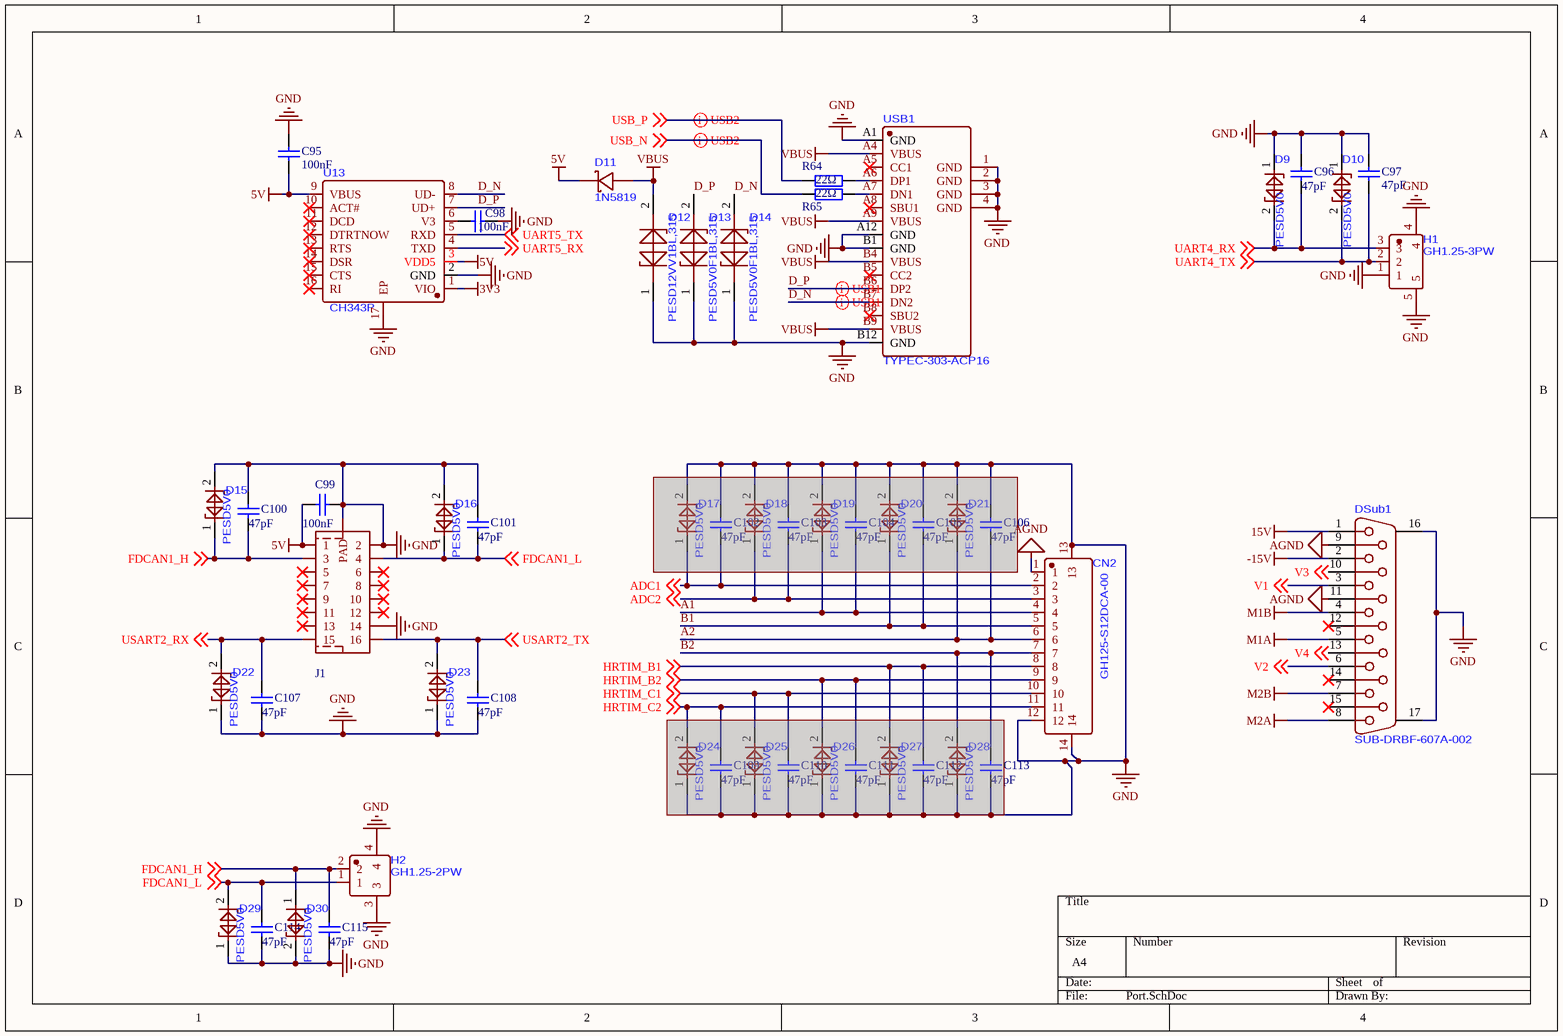
[diagram p5: Port.SchDoc]

### Parts
C95  100nF  [0402_C]
C96  47pF  [0402_C]
C97  47pF  [0402_C]
C98  100nF  [0402_C]
C99  100nF  [0402_C]
C100  47pF  [0402_C]
C101  47pF  [0402_C]
C102  47pF  [0402_C]  (masked out: inside a compile mask, not in the netlist)
C103  47pF  [0402_C]  (masked out: inside a compile mask, not in the netlist)
C104  47pF  [0402_C]  (masked out: inside a compile mask, not in the netlist)
C105  47pF  [0402_C]  (masked out: inside a compile mask, not in the netlist)
C106  47pF  [0402_C]  (masked out: inside a compile mask, not in the netlist)
C107  47pF  [0402_C]
C108  47pF  [0402_C]
C109  47pF  [0402_C]  (masked out: inside a compile mask, not in the netlist)
C110  47pF  [0402_C]  (masked out: inside a compile mask, not in the netlist)
C111  47pF  [0402_C]  (masked out: inside a compile mask, not in the netlist)
C112  47pF  [0402_C]  (masked out: inside a compile mask, not in the netlist)
C113  47pF  [0402_C]  (masked out: inside a compile mask, not in the netlist)
C114  47pF  [0402_C]
C115  47pF  [0402_C]
CN2  GH125-S12DCA-00  [CONN-SMD_12P-P1.25_GH125-S12DCA-00]
D9  PESD5V0  [SOD-882_L1.0-W0.6-BI]
D10  PESD5V0  [SOD-882_L1.0-W0.6-BI]
D11  1N5819  [DO-214AC_L4.3-W2.7-LS5.3-RD]
D12  PESD12VV1BL,315  [SOD-882_L1.0-W0.6-BI]
D13  PESD5V0F1BL,315  [SOD-882_L1.0-W0.6-BI]
D14  PESD5V0F1BL,315  [SOD-882_L1.0-W0.6-BI]
D15  PESD5V0  [SOD-882_L1.0-W0.6-BI]
D16  PESD5V0  [SOD-882_L1.0-W0.6-BI]
D17  PESD5V0  [SOD-882_L1.0-W0.6-BI]  (masked out: inside a compile mask, not in the netlist)
D18  PESD5V0  [SOD-882_L1.0-W0.6-BI]  (masked out: inside a compile mask, not in the netlist)
D19  PESD5V0  [SOD-882_L1.0-W0.6-BI]  (masked out: inside a compile mask, not in the netlist)
D20  PESD5V0  [SOD-882_L1.0-W0.6-BI]  (masked out: inside a compile mask, not in the netlist)
D21  PESD5V0  [SOD-882_L1.0-W0.6-BI]  (masked out: inside a compile mask, not in the netlist)
D22  PESD5V0  [SOD-882_L1.0-W0.6-BI]
D23  PESD5V0  [SOD-882_L1.0-W0.6-BI]
D24  PESD5V0  [SOD-882_L1.0-W0.6-BI]  (masked out: inside a compile mask, not in the netlist)
D25  PESD5V0  [SOD-882_L1.0-W0.6-BI]  (masked out: inside a compile mask, not in the netlist)
D26  PESD5V0  [SOD-882_L1.0-W0.6-BI]  (masked out: inside a compile mask, not in the netlist)
D27  PESD5V0  [SOD-882_L1.0-W0.6-BI]  (masked out: inside a compile mask, not in the netlist)
D28  PESD5V0  [SOD-882_L1.0-W0.6-BI]  (masked out: inside a compile mask, not in the netlist)
D29  PESD5V0  [SOD-882_L1.0-W0.6-BI]
D30  PESD5V0  [SOD-882_L1.0-W0.6-BI]
DSub1  SUB-DRBF-607A-002  [DSUB-TH_FDB1502-F0DB300K6KA]
H1  GH1.25-3PW  [CONN-SMD_GH1.25-3P]
H2  GH1.25-2PW  [CONN-TH_2P-P1.25_XUNPU_WAFER-GH1.25-2PLB]
J1  2*8P MTI630  [2*8P MTI630]  (value not drawn)
R64  22Ω  [0402_R]
R65  22Ω  [0402_R]
U13  CH343P  [TQFN-16_L3.0-W3.0-P0.50-BL-EP1.7]
USB1  TYPEC-303-ACP16  [USB-C-SMD_TYPEC-303-ACP16]

### Nets
3V3: U13.1(VIO)
5V: C95.2 C99.1 D11.1(C) J1.1 U13.3(VDD5) U13.9(VBUS)
15V: DSub1.1
-15V: DSub1.2
AGND: CN2.1 DSub1.9 DSub1.11
GND: C95.1 C96.2 C97.2 C98.1 C99.2 C100.2 C101.2 C107.1 C108.1 C114.1 C115.1 CN2.12 CN2.13 CN2.14 D9.1 D10.1 D12.1 D13.1 D14.1 D15.2 D16.2 D22.1 D23.1 D29.1 D30.2 DSub1.16(MH2) DSub1.17(MH1) H1.1 H1.4 H1.5 H2.3 H2.4 J1.2 J1.14 J1.17(PAD) U13.2(GND) U13.17(EP) USB1.1(GND) USB1.2(GND) USB1.3(GND) USB1.4(GND) USB1.A1(GND) USB1.A12(GND) USB1.B1(GND) USB1.B12(GND)
M1A: DSub1.5
M1B: DSub1.4
M2A: DSub1.8
M2B: DSub1.7
VBUS: D11.2(A) D12.2 USB1.A4(VBUS) USB1.A9(VBUS) USB1.B4(VBUS) USB1.B9(VBUS)
A1: CN2.4
A2: CN2.6
ADC1: CN2.2 ; off-sheet ADC1
ADC2: CN2.3 ; off-sheet ADC2
B1: CN2.5
B2: CN2.7
D_N: D14.2 U13.8(UD-) USB1.B7(DN2)
D_P: D13.2 U13.7(UD+) USB1.B6(DP2)
FDCAN1_H: C100.1 C115.2 D15.1 D30.1 H2.2 J1.3 ; off-sheet FDCAN1_H
FDCAN1_L: C101.1 C114.2 D16.1 D29.2 H2.1 J1.4 ; off-sheet FDCAN1_L
HRTIM_B1: CN2.8 ; off-sheet HRTIM_B1
HRTIM_B2: CN2.9 ; off-sheet HRTIM_B2
HRTIM_C1: CN2.10 ; off-sheet HRTIM_C1
HRTIM_C2: CN2.11 ; off-sheet HRTIM_C2
UART4_RX: C96.1 D9.2 H1.3 ; off-sheet UART4_RX
UART4_TX: C97.1 D10.2 H1.2 ; off-sheet UART4_TX
UART5_RX: U13.4(TXD) ; off-sheet UART5_RX
UART5_TX: U13.5(RXD) ; off-sheet UART5_TX
USART2_RX: C107.2 D22.2 J1.15 ; off-sheet USART2_RX
USART2_TX: C108.2 D23.2 J1.16 ; off-sheet USART2_TX
USB_N: R65.1 ; off-sheet USB_N
USB_P: R64.1 ; off-sheet USB_P
V1: DSub1.3 ; off-sheet V1
V2: DSub1.6 ; off-sheet V2
V3: DSub1.10 ; off-sheet V3
V4: DSub1.13 ; off-sheet V4
NetC98_2: C98.2 U13.6(V3)
NetR64_2: R64.2 USB1.A6(DP1)
NetR65_2: R65.2 USB1.A7(DN1)

Not connected (* = marked no-connect by the designer): DSub1 12* 14* 15*; J1 5* 6* 7* 8* 9* 10* 11* 12* 13*; U13 10(ACT#)* 11(DCD)* 12(DTRTNOW)* 13(RTS)* 14(DSR)* 15(CTS)* 16(RI)*; USB1 A5(CC1)* A8(SBU1)* B5(CC2)* B8(SBU2)*

### Layout directives
differential pair: D_N, D_P, USB_N, USB_P

### Library data of the parts
C95 C98 C99 = 0402 100nF (104) 10% 16V: 贴片电容; ComponentLink1Description: 供应商链接; ComponentLink1URL: http://www.szlcsc.com/product/details_1877.html; Package: 0402; Supplier: LC; SuppliersPartNumber: C1525
C96 C97 C100-C115 = 0402 47pF (470) 5% 50V: 贴片电容; ComponentLink1Description: 供应商链接; ComponentLink1URL: http://www.szlcsc.com/product/details_1919.html; Package: 0402; Supplier: LC; SuppliersPartNumber: C1567
D9 D10 D12 D15-D30 = PESD5V0F1BL,315
D11 = 1N5819(SS14)
R64 R65 = 0402 120Ω (1200) 1%: 贴片电阻; ComponentLink1Description: 供应商链接; ComponentLink1URL: http://www.szlcsc.com/product/details_25822.html; Package: 0402; Supplier: LC; SuppliersPartNumber: C25079

## Sheet Others.SchDoc
size A4; SheetNumber: 7; SheetTotal: 7
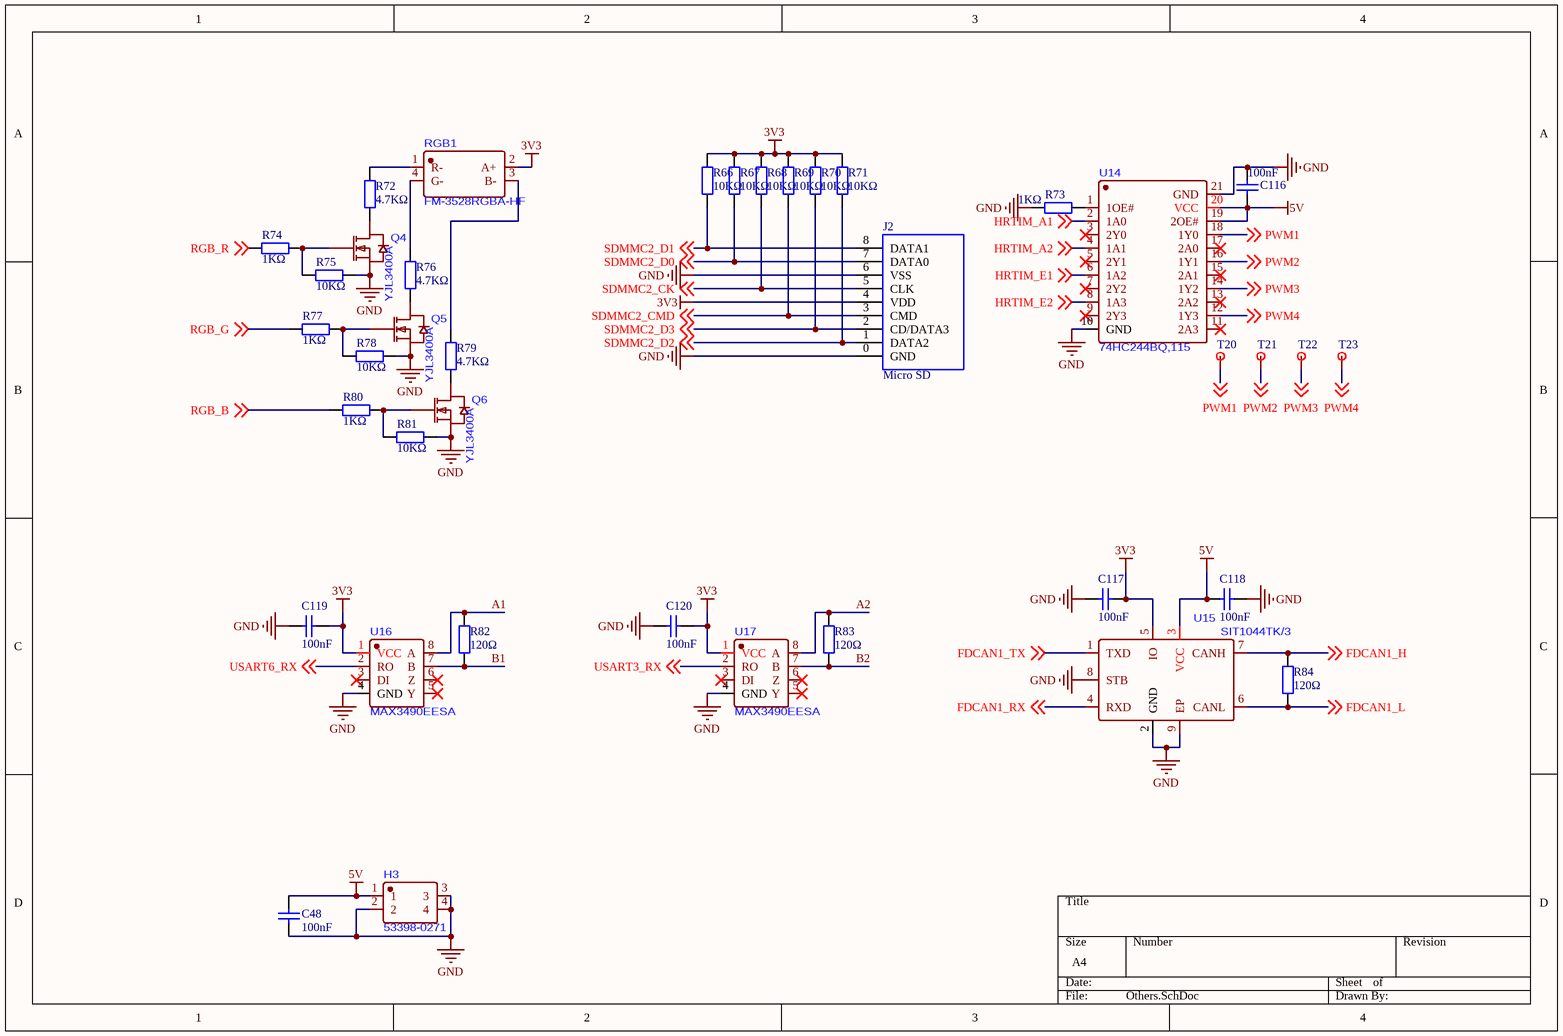
[diagram p6: Others.SchDoc]

### Parts
C48  100nF  [0402_C]
C116  100nF  [0402_C]
C117  100nF  [0402_C]
C118  100nF  [0402_C]
C119  100nF  [0402_C]
C120  100nF  [0402_C]
H3  53398-0271  [CONN-SMD_2P-P1.25_53398-0271]
J2  Micro SD  [SD卡座短]
Q4  YJL3400A  [SOT-23-3_L2.9-W1.3-P1.90-LS2.4-BR]
Q5  YJL3400A  [SOT-23-3_L2.9-W1.3-P1.90-LS2.4-BR]
Q6  YJL3400A  [SOT-23-3_L2.9-W1.3-P1.90-LS2.4-BR]
R66  10KΩ  [0402_R]
R67  10KΩ  [0402_R]
R68  10KΩ  [0402_R]
R69  10KΩ  [0402_R]
R70  10KΩ  [0402_R]
R71  10KΩ  [0402_R]
R72  4.7KΩ  [0402_R]
R73  1KΩ  [0402_R]
R74  1KΩ  [0402_R]
R75  10KΩ  [0402_R]
R76  4.7KΩ  [0402_R]
R77  1KΩ  [0402_R]
R78  10KΩ  [0402_R]
R79  4.7KΩ  [0402_R]
R80  1KΩ  [0402_R]
R81  10KΩ  [0402_R]
R82  120Ω  [0402_R]
R83  120Ω  [0402_R]
R84  120Ω  [0402_R]
RGB1  FM-3528RGBA-HF  [LED-SMD_4P-L3.2-W2.8-LS3.5-BR-1]
T20  testpoint  [testpoint]  (value not drawn)
T21  testpoint  [testpoint]  (value not drawn)
T22  testpoint  [testpoint]  (value not drawn)
T23  testpoint  [testpoint]  (value not drawn)
U14  74HC244BQ,115  [DHVQFN20_L4.5-W2.5-P0.50-BL-EP]
U15  SIT1044TK/3  [TDFN-8_L3.0-W3.0-P0.65-BL-EP]
U16  MAX3490EESA  [SOIC-8_L4.9-W3.9-P1.27-LS6.0-BL]
U17  MAX3490EESA  [SOIC-8_L4.9-W3.9-P1.27-LS6.0-BL]

### Nets
3V3: C117.1 C119.1 C120.1 J2.4(VDD) R66.2 R67.2 R68.2 R69.2 R70.2 R71.2 RGB1.2(A+) U15.5(IO) U16.1(VCC) U17.1(VCC)
5V: C48.1 C116.1 C118.2 H3.1 U14.19(2OE#) U14.20(VCC) U15.3(VCC)
GND: C48.2 C116.2 C117.2 C118.1 C119.2 C120.2 H3.2 H3.3 H3.4 J2.0(GND) J2.6(VSS) Q4.2(S) Q5.2(S) Q6.2(S) R73.1 R75.2 R78.2 R81.2 U14.10(GND) U14.21(GND) U15.2(GND) U15.8(STB) U15.9(EP) U16.4(GND) U17.4(GND)
A1: R82.2 U16.8(A)
A2: R83.2 U17.8(A)
B1: R82.1 U16.7(B)
B2: R83.1 U17.7(B)
FDCAN1_H: R84.2 U15.7(CANH) ; off-sheet FDCAN1_H
FDCAN1_L: R84.1 U15.6(CANL) ; off-sheet FDCAN1_L
FDCAN1_RX: U15.4(RXD) ; off-sheet FDCAN1_RX
FDCAN1_TX: U15.1(TXD) ; off-sheet FDCAN1_TX
HRTIM_A1: U14.2(1A0) ; off-sheet HRTIM_A1
HRTIM_A2: U14.4(1A1) ; off-sheet HRTIM_A2
HRTIM_E1: U14.6(1A2) ; off-sheet HRTIM_E1
HRTIM_E2: U14.8(1A3) ; off-sheet HRTIM_E2
PWM1: T20.1(R) U14.18(1Y0) ; off-sheet PWM1
PWM2: T21.1(R) U14.16(1Y1) ; off-sheet PWM2
PWM3: T22.1(R) U14.14(1Y2) ; off-sheet PWM3
PWM4: T23.1(R) U14.12(1Y3) ; off-sheet PWM4
RGB_B: R80.1 ; off-sheet RGB_B
RGB_G: R77.1 ; off-sheet RGB_G
RGB_R: R74.1 ; off-sheet RGB_R
SDMMC2_CK: J2.5(CLK) R68.1 ; off-sheet SDMMC2_CK
SDMMC2_CMD: J2.3(CMD) R69.1 ; off-sheet SDMMC2_CMD
SDMMC2_D0: J2.7(DATA0) R67.1 ; off-sheet SDMMC2_D0
SDMMC2_D1: J2.8(DATA1) R66.1 ; off-sheet SDMMC2_D1
SDMMC2_D2: J2.1(DATA2) R71.1 ; off-sheet SDMMC2_D2
SDMMC2_D3: J2.2(CD/DATA3) R70.1 ; off-sheet SDMMC2_D3
USART3_RX: U17.2(RO) ; off-sheet USART3_RX
USART6_RX: U16.2(RO) ; off-sheet USART6_RX
NetQ4_1: Q4.1(G) R74.2 R75.1
NetQ4_3: Q4.3(D) R72.1
NetQ5_1: Q5.1(G) R77.2 R78.1
NetQ5_3: Q5.3(D) R76.1
NetQ6_1: Q6.1(G) R80.2 R81.1
NetQ6_3: Q6.3(D) R79.1
NetR72_2: R72.2 RGB1.1(R-)
NetR73_2: R73.2 U14.1(1OE#)
NetR76_2: R76.2 RGB1.4(G-)
NetR79_2: R79.2 RGB1.3(B-)

Not connected (* = marked no-connect by the designer): U14 3(2Y0)* 5(2Y1)* 7(2Y2)* 9(2Y3)* 11(2A3)* 13(2A2)* 15(2A1)* 17(2A0)*; U16 3(DI)* 5(Y)* 6(Z)*; U17 3(DI)* 5(Y)* 6(Z)*

### Library data of the parts
C48 C116-C120 = 0402 100nF (104) 10% 16V: 贴片电容; ComponentLink1Description: 供应商链接; ComponentLink1URL: http://www.szlcsc.com/product/details_1877.html; Package: 0402; Supplier: LC; SuppliersPartNumber: C1525
J2 = SD卡 短: Micro SD卡; 版权归属: 黎明电子style; BOM名称: Micro SD卡; 学习资源: https://lmdzstyle.taobao.com/
R66-R81 = 0402 10KΩ (1002) 1%: 贴片电阻; ComponentLink1Description: 供应商链接; ComponentLink1URL: http://www.szlcsc.com/product/details_26487.html; Package: 0402; Supplier: LC; SuppliersPartNumber: C25744
R82-R84 = 0402 120Ω (1200) 1%: 贴片电阻; ComponentLink1Description: 供应商链接; ComponentLink1URL: http://www.szlcsc.com/product/details_25822.html; Package: 0402; Supplier: LC; SuppliersPartNumber: C25079

## Nets that join several sheets
3V3: Core (7 pins), Power_1 (R37.2 T4.1), Power_2 (36 pins), ADC (7 pins), HBridge (C47.2 C73.2 U9.4 U10.4), Port (U13.1), Others (14 pins)
5V: Power_1 (R31.2 T2.1), Power_2 (FB2.1), Port (6 pins), Others (7 pins)
15V: Power_1 (R44.2 T10.1), Port (DSub1.1)
-15V: Power_1 (R51.2 T12.1), Port (DSub1.2)
AGND: Power_2 (20 pins), ADC (19 pins), Port (CN2.1 DSub1.9 DSub1.11)
GND: Core (10 pins), Power_1 (43 pins), Power_2 (60 pins), HBridge (C47.1 C73.1 U9.1 U10.1), Port (45 pins), Others (25 pins)
M1A: HBridge (T16.1 U9.6), Port (DSub1.5)
M1B: HBridge (T17.1 U9.8), Port (DSub1.4)
M2A: HBridge (T18.1 U10.6), Port (DSub1.8)
M2B: HBridge (T19.1 U10.8), Port (DSub1.7)
PGND: Power_1 (FB1.2 T6.1), HBridge (10 pins)
VIN: Power_1 (19 pins), ADC (R56.1 R58.1)
VIN_A: ADC (R56.2), HBridge (C81.2 C82.2 C85.2 U9.5)
VIN_B: ADC (R58.2), HBridge (C88.2 C93.2 C94.2 U10.5)
A1: Port (CN2.4), Others (R82.2 U16.8)
A2: Port (CN2.6), Others (R83.2 U17.8)
ADC1: ADC (U6.61), Port (CN2.2)
ADC2: ADC (U6.63), Port (CN2.3)
B1: Port (CN2.5), Others (R82.1 U16.7)
B2: Port (CN2.7), Others (R83.1 U17.7)
EXIT3: Core (U2.D11), ADC (U6.14)
FDCAN1_H: Port (6 pins), Others (R84.2 U15.7)
FDCAN1_L: Port (6 pins), Others (R84.1 U15.6)
FDCAN1_RX: Core (R24.1), Others (U15.4)
FDCAN1_TX: Core (R25.1), Others (U15.1)
FMC_D0: Core (U2.M14), ADC (U6.16)
FMC_D1: Core (U2.L14), ADC (U6.17)
FMC_D2: Core (U2.B12), ADC (U6.18)
FMC_D3: Core (U2.C12), ADC (U6.19)
FMC_D4: Core (U2.R8), ADC (U6.20)
FMC_D5: Core (U2.P8), ADC (U6.21)
FMC_D6: Core (U2.P9), ADC (U6.22)
FMC_D7: Core (U2.R9), ADC (U6.24)
FMC_D8: Core (U2.P10), ADC (U6.25)
FMC_D9: Core (U2.R10), ADC (U6.27)
FMC_D10: Core (U2.N11), ADC (U6.28)
FMC_D11: Core (U2.P11), ADC (U6.29)
FMC_D12: Core (U2.R11), ADC (U6.30)
FMC_D13: Core (U2.P15), ADC (U6.31)
FMC_D14: Core (U2.P14), ADC (U6.32)
FMC_D15: Core (U2.N15), ADC (U6.33)
FMC_NE4: Core (U2.B8), ADC (U6.13)
FMC_NOE: Core (U2.D10), ADC (U6.12)
HRTIM_A1: Core (R7.2), Others (U14.2)
HRTIM_A2: Core (R9.2), Others (U14.4)
HRTIM_B1: Core (R12.2), Port (CN2.8)
HRTIM_B2: Core (R11.1), Port (CN2.9)
HRTIM_C1: Core (R13.1), Port (CN2.10)
HRTIM_C2: Core (R15.1), Port (CN2.11)
HRTIM_E1: Core (R8.2), Others (U14.6)
HRTIM_E2: Core (R10.2), Others (U14.8)
PB10: Core (U2.R12), ADC (U6.11)
PB11: Core (U2.R13), ADC (U6.8)
PF14: Core (U2.R7), ADC (U6.5)
PG2: Core (U2.L15), ADC (U6.3)
PG3: Core (U2.K15), ADC (U6.4)
PWM1: HBridge (U9.3), Others (T20.1 U14.18)
PWM2: HBridge (U9.2), Others (T21.1 U14.16)
PWM3: HBridge (U10.2), Others (T22.1 U14.14)
PWM4: HBridge (U10.3), Others (T23.1 U14.12)
RGB_B: Core (U2.R4), Others (R80.1)
RGB_G: Core (U2.R5), Others (R77.1)
RGB_R: Core (U2.R3), Others (R74.1)
SDMMC2_CK: Core (R4.2), Others (J2.5 R68.1)
SDMMC2_CMD: Core (R23.2), Others (J2.3 R69.1)
SDMMC2_D0: Core (R28.1), Others (J2.7 R67.1)
SDMMC2_D1: Core (R30.1), Others (J2.8 R66.1)
SDMMC2_D2: Core (R17.2), Others (J2.1 R71.1)
SDMMC2_D3: Core (R20.1), Others (J2.2 R70.1)
TIM4_CH2: Core (R26.2), ADC (U6.9 U6.10)
UART4_RX: Core (R29.1), Port (C96.1 D9.2 H1.3)
UART4_TX: Core (R27.1), Port (C97.1 D10.2 H1.2)
UART5_RX: Core (R19.1), Port (U13.4)
UART5_TX: Core (R18.1), Port (U13.5)
USART2_RX: Core (R22.2), Port (C107.2 D22.2 J1.15)
USART2_TX: Core (R21.2), Port (C108.2 D23.2 J1.16)
USART3_RX: Core (R16.2), Others (U17.2)
USART6_RX: Core (R14.2), Others (U16.2)
USB_N: Core (U2.C15), Port (R65.1)
USB_P: Core (U2.B15), Port (R64.1)
V1: ADC (U6.49), Port (DSub1.3)
V2: ADC (U6.51), Port (DSub1.6)
V3: ADC (U6.53), Port (DSub1.10)
V4: ADC (U6.55), Port (DSub1.13)